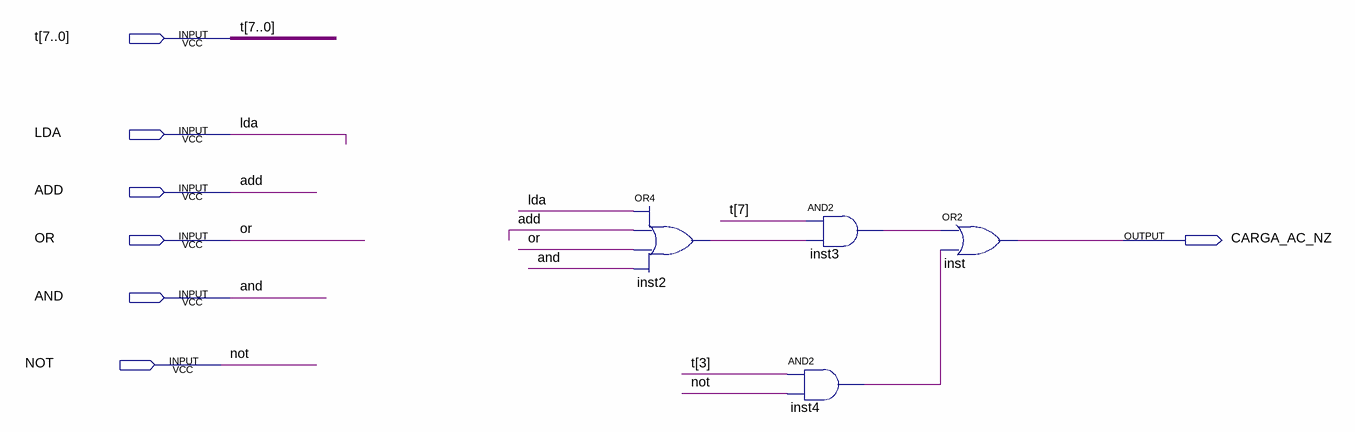
[diagram p0: schematic sheet]
// Quartus schematic CARGA_AC_NZ.bdf as structural Verilog: 4 symbols, 7 pins
module CARGA_AC_NZ (
  input  [7:0] t,
  input  LDA,
  input  ADD,
  input  OR,
  input  AND,
  input  NOT,
  output CARGA_AC_NZ
);

  wire inst2_out, inst3_out, inst4_out;

  or inst2 (inst2_out, LDA, ADD, OR, AND);
  and inst3 (inst3_out, t[7], inst2_out);
  and inst4 (inst4_out, t[3], NOT);
  or inst (CARGA_AC_NZ, inst3_out, inst4_out);
endmodule
